# EAGLE design motadora (EAGLE 8.2.0)
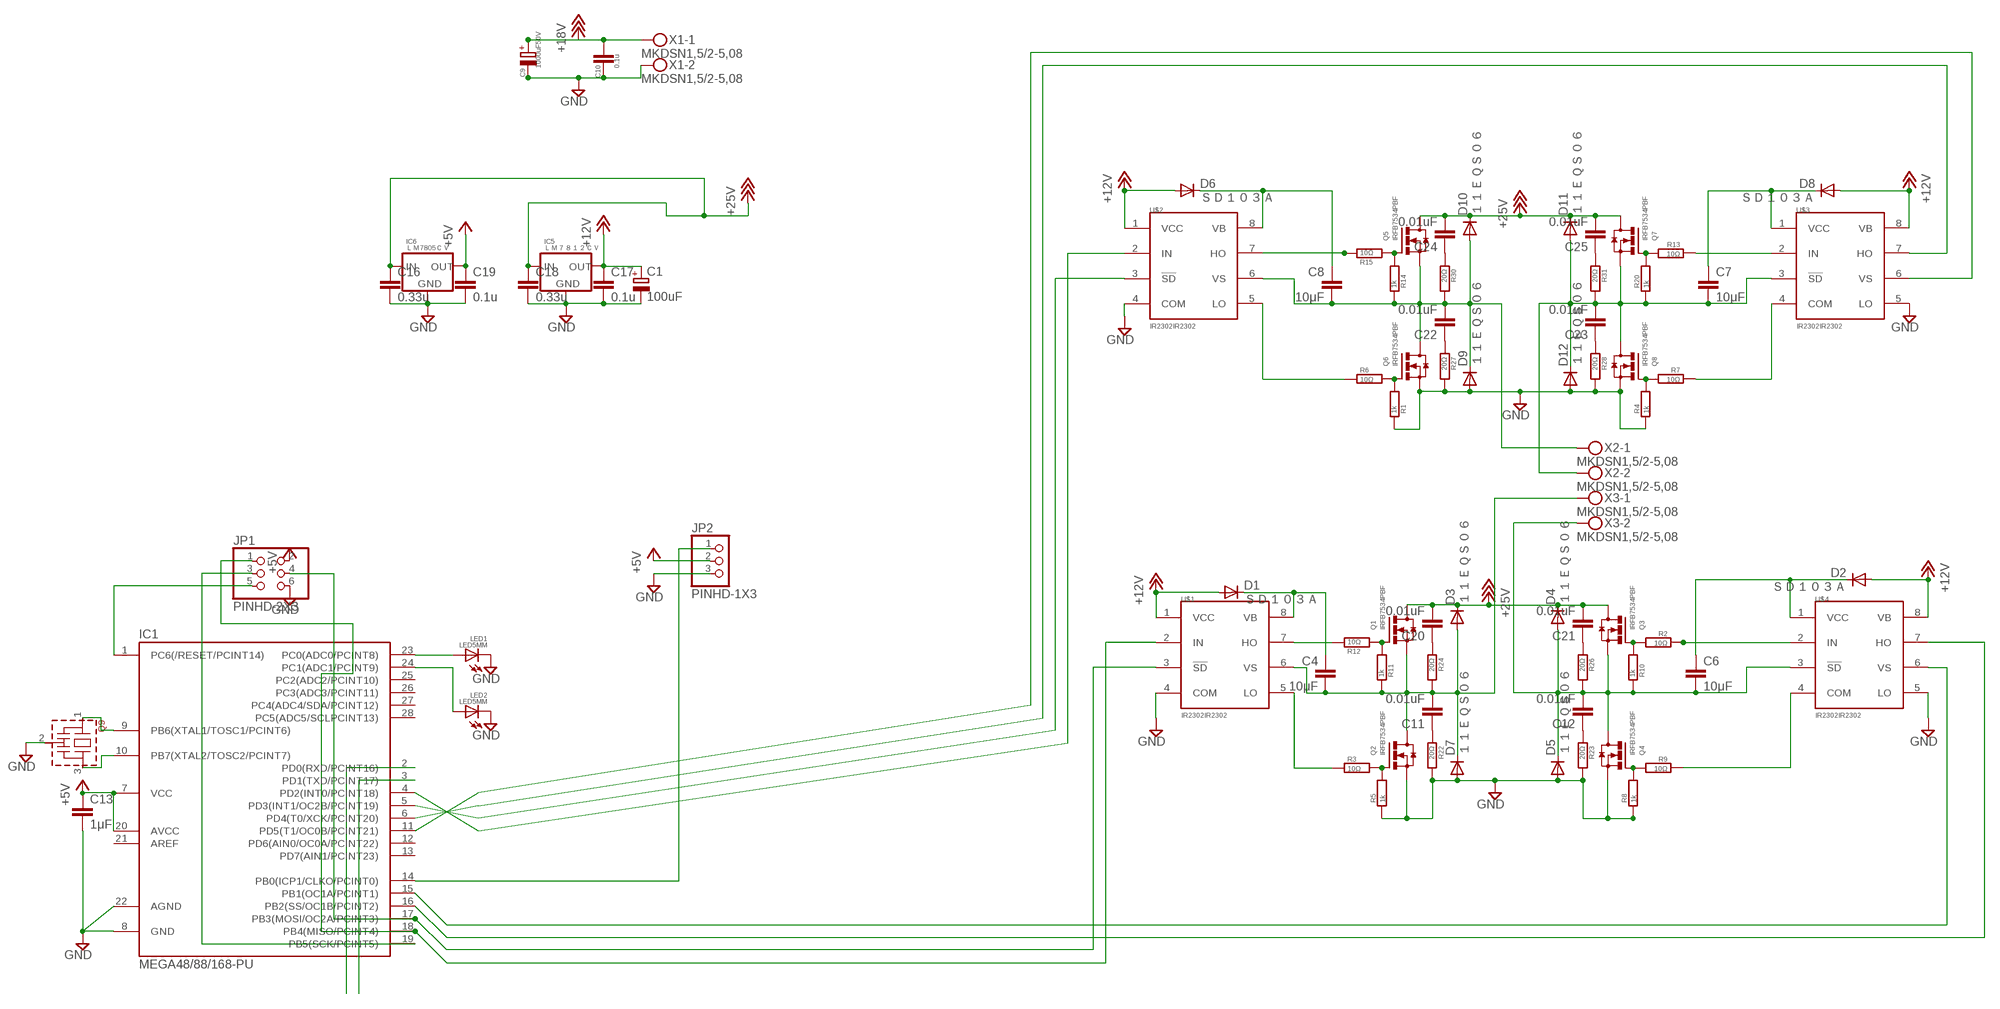
[diagram p0: schematic, sheet 1]

## Parts
C1  100uF  CPOL-EUTT2D6  [TT2D6]
C4  10μF  C-EU025-025X050  [C025-025X050]
C6  10μF  C-EU025-025X050  [C025-025X050]
C7  10μF  C-EU025-025X050  [C025-025X050]
C8  10μF  C-EU025-025X050  [C025-025X050]
C9  1000uF50V  CPOL-E2.5-7  [E2,5-7]
C10  0.1u  C-025-025X050  [C025-025X050]
C11  0.01uF  C-EU025-024X044  [C025-024X044]
C12  0.01uF  C-EU025-024X044  [C025-024X044]
C13  1μF  C-EU050-025X075  [C050-025X075]
C16  0.33u  C-EU025-025X050  [C025-025X050]
C17  0.1u  C-EU025-025X050  [C025-025X050]
C18  0.33u  C-EU025-025X050  [C025-025X050]
C19  0.1u  C-EU025-025X050  [C025-025X050]
C20  0.01uF  C-EU025-024X044  [C025-024X044]
C21  0.01uF  C-EU025-024X044  [C025-024X044]
C22  0.01uF  C-EU025-024X044  [C025-024X044]
C23  0.01uF  C-EU025-024X044  [C025-024X044]
C24  0.01uF  C-EU025-024X044  [C025-024X044]
C25  0.01uF  C-EU025-024X044  [C025-024X044]
D1  ＳＤ１０３Ａ  DIODE-D-5  [D-5]
D2  ＳＤ１０３Ａ  DIODE-D-5  [D-5]
D3  １１ＥＱＳ０６  DIODE-D-5  [D-5]
D4  １１ＥＱＳ０６  DIODE-D-5  [D-5]
D5  １１ＥＱＳ０６  DIODE-D-5  [D-5]
D6  ＳＤ１０３Ａ  DIODE-D-5  [D-5]
D7  １１ＥＱＳ０６  DIODE-D-5  [D-5]
D8  ＳＤ１０３Ａ  DIODE-D-5  [D-5]
D9  １１ＥＱＳ０６  DIODE-D-5  [D-5]
D10  １１ＥＱＳ０６  DIODE-D-5  [D-5]
D11  １１ＥＱＳ０６  DIODE-D-5  [D-5]
D12  １１ＥＱＳ０６  DIODE-D-5  [D-5]
IC1  MEGA48/88/168-PU  [DIL28-3]
IC5  ＬＭ７８１２ＣＶ  V-REGTO-92  [TO-92]
IC6  ＬＭ7805ＣＶ  V-REGTO-92  [TO-92]
JP1  PINHD-2X3  [2X03]
JP2  PINHD-1X3  [1X03]
LED1  LED5MM  [LED5MM]
LED2  LED5MM  [LED5MM]
Q1  IRFB7534PBF  MOS-FET_NTO-220_2  [TO220_2]
Q2  IRFB7534PBF  MOS-FET_NTO-220_2  [TO220_2]
Q3  IRFB7534PBF  MOS-FET_NTO-220_2  [TO220_2]
Q4  IRFB7534PBF  MOS-FET_NTO-220_2  [TO220_2]
Q5  IRFB7534PBF  MOS-FET_NTO-220_2  [TO220_2]
Q6  IRFB7534PBF  MOS-FET_NTO-220_2  [TO220_2]
Q7  IRFB7534PBF  MOS-FET_NTO-220_2  [TO220_2]
Q8  IRFB7534PBF  MOS-FET_NTO-220_2  [TO220_2]
Q9  CSTLS_X  [CSTLS_X]
R1  1k  R-EU_1/4W(8MM)  [1/4W(8MM)]
R2  10Ω  R-EU_1/4W(2.5MM)_  [1/4W(2.5MM)_]
R3  10Ω  R-EU_1/4W(2.5MM)_  [1/4W(2.5MM)_]
R4  1k  R-EU_1/4W(8MM)  [1/4W(8MM)]
R5  1k  R-EU_1/4W(8MM)  [1/4W(8MM)]
R6  10Ω  R-EU_1/4W(2.5MM)_  [1/4W(2.5MM)_]
R7  10Ω  R-EU_1/4W(2.5MM)_  [1/4W(2.5MM)_]
R8  1k  R-EU_1/4W(8MM)  [1/4W(8MM)]
R9  10Ω  R-EU_1/4W(2.5MM)_  [1/4W(2.5MM)_]
R10  1k  R-EU_1/4W(8MM)  [1/4W(8MM)]
R11  1k  R-EU_1/4W(8MM)  [1/4W(8MM)]
R12  10Ω  R-EU_1/4W(2.5MM)_  [1/4W(2.5MM)_]
R13  10Ω  R-EU_1/4W(2.5MM)_  [1/4W(2.5MM)_]
R14  1k  R-EU_1/4W(8MM)  [1/4W(8MM)]
R15  10Ω  R-EU_1/4W(2.5MM)_  [1/4W(2.5MM)_]
R20  1k  R-EU_1/4W(8MM)  [1/4W(8MM)]
R22  20Ω  R-EU_1/4W(2.5MM)_  [1/4W(2.5MM)_]
R23  20Ω  R-EU_1/4W(2.5MM)_  [1/4W(2.5MM)_]
R24  20Ω  R-EU_1/4W(2.5MM)_  [1/4W(2.5MM)_]
R26  20Ω  R-EU_1/4W(2.5MM)_  [1/4W(2.5MM)_]
R27  20Ω  R-EU_1/4W(2.5MM)_  [1/4W(2.5MM)_]
R28  20Ω  R-EU_1/4W(2.5MM)_  [1/4W(2.5MM)_]
R30  20Ω  R-EU_1/4W(2.5MM)_  [1/4W(2.5MM)_]
R31  20Ω  R-EU_1/4W(2.5MM)_  [1/4W(2.5MM)_]
U$1  IR2302IR2302  [DIL08]
U$2  IR2302IR2302  [DIL08]
U$3  IR2302IR2302  [DIL08]
U$4  IR2302IR2302  [DIL08]
X1  MKDSN1,5/2-5,08  [MKDSN1,5/2-5,08]
X2  MKDSN1,5/2-5,08  [MKDSN1,5/2-5,08]
X3  MKDSN1,5/2-5,08  [MKDSN1,5/2-5,08]

## Nets
+5V: C13.1 C19.1 IC1.7(VCC) IC1.20(AVCC) IC6.3(OUT) JP1.2 JP2.2
+12V: C1.+ C17.1 D1.A D2.A D6.A D8.A IC5.3(OUT) U$1.1(VCC) U$2.1(VCC) U$3.8(VB) U$4.8(VB)
+18V: C9.+ C10.1 C16.1 C18.1 C20.2 C21.2 C24.2 C25.2 D3.C D4.C D10.C D11.C IC5.1(IN) IC6.1(IN) Q1.2(D) Q3.2(D) Q5.2(D) Q7.2(D) X1.1 ; supply symbol labelled +25V
GND: C1.- C9.- C10.2 C13.2 C16.2 C17.2 C18.2 C19.2 D5.A D7.A D9.A D12.A IC1.8(GND) IC5.2(GND) IC6.2(GND) JP1.6 JP2.3 LED1.K(C) LED2.K(C) Q2.3(S) Q4.3(S) Q6.3(S) Q8.3(S) Q9.2(VSS) R1.1 R4.1 R5.1 R8.1 R22.4 R23.4 R27.4 R28.4 U$1.4(COM) U$2.4(COM) U$3.5(LO) U$4.5(LO) X1.2
N$1: R15.3 U$2.7(HO)
N$2: R13.3 U$3.2(IN)
N$3: R12.3 U$1.7(HO)
N$4: Q2.1(G) R3.4 R5.2
N$5: IC1.10(PB7(XTAL2/TOSC2/PCINT7)) Q9.3
N$6: R6.3 U$2.5(LO)
N$7: Q1.1(G) R11.2 R12.4
N$8: C4.2 C11.2 D3.A D7.C Q1.3(S) Q2.2(D) R11.1 R24.4 U$1.6(VS) X3.1
N$9: C4.1 D1.C U$1.8(VB)
N$10: C6.1 D2.C U$4.1(VCC)
N$11: R3.3 U$1.5(LO)
N$12: C7.1 D8.C U$3.1(VCC)
N$13: Q5.1(G) R14.2 R15.4
N$15: C6.2 C12.2 D4.A D5.C Q3.3(S) Q4.2(D) R10.1 R26.4 U$4.3(!SD) X3.2
N$16: C8.1 D6.C U$2.8(VB)
N$17: Q4.1(G) R8.2 R9.4
N$18: IC1.14(PB0(ICP1/CLKO/PCINT0)) JP2.1
N$19: C7.2 C23.2 D11.A D12.C Q7.3(S) Q8.2(D) R20.1 R31.4 U$3.3(!SD) X2.2
N$20: IC1.17(PB3(MOSI/OC2A/PCINT3)) JP1.4 U$1.3(!SD)
N$21: Q6.1(G) R1.2 R6.4
N$22: IC1.9(PB6(XTAL1/TOSC1/PCINT6)) Q9.1
N$23: IC1.15(PB1(OC1A/PCINT1)) U$4.6(VS)
N$24: IC1.5(PD3(INT1/OC2B/PCINT19)) U$2.3(!SD)
N$25: IC1.2(PD0(RXD/PCINT16))
N$26: Q8.1(G) R4.2 R7.4
N$27: C8.2 C22.2 D9.C D10.A Q5.3(S) Q6.2(D) R14.1 R30.4 U$2.6(VS) X2.1
N$32: IC1.16(PB2(SS/OC1B/PCINT2)) U$4.7(HO)
N$33: IC1.23(PC0(ADC0/PCINT8)) LED1.A
N$34: IC1.24(PC1(ADC1/PCINT9)) LED2.A
N$36: C12.1 R23.3
N$38: C11.1 R22.3
N$39: Q3.1(G) R2.4 R10.2
N$40: R7.3 U$3.4(COM)
N$41: IC1.6(PD4(T0/XCK/PCINT20)) U$3.7(HO)
N$42: C20.1 R24.3
N$43: C21.1 R26.3
N$44: C22.1 R27.3
N$45: C23.1 R28.3
N$46: C24.1 R30.3
N$47: C25.1 R31.3
N$48: R2.3 U$4.2(IN)
N$49: IC1.11(PD5(T1/OC0B/PCINT21)) U$3.6(VS)
N$50: IC1.18(PB4(MISO/PCINT4)) JP1.1 U$1.2(IN)
N$51: Q7.1(G) R13.4 R20.2
N$52: IC1.4(PD2(INT0/PCINT18)) U$2.2(IN)
N$54: R9.3 U$4.4(COM)
N$55: IC1.3(PD1(TXD/PCINT17))
N$56: IC1.19(PB5(SCK/PCINT5)) JP1.3
N$57: IC1.1(PC6(/RESET/PCINT14)) JP1.5
Unconnected: IC1.12(PD6(AIN0/OC0A/PCINT22)) IC1.13(PD7(AIN1/PCINT23)) IC1.21(AREF) IC1.25(PC2(ADC2/PCINT10)) IC1.26(PC3(ADC3/PCINT11)) IC1.27(PC4(ADC4/SDA/PCINT12)) IC1.28(PC5(ADC5/SCLPCINT13))

## Power pins joined to a net without a drawn wire
AGND: IC1.22(AGND)

## Library data of the parts
C1 = _rcl:CPOL-EU: POLARIZED CAPACITOR, European symbol
C4 C6-C8 = _rcl:C-EU: CAPACITOR, European symbol
C9 = !capasiter:CPOL-: POLARIZED CAPACITOR, European symbol
C10 = !capasiter:C-: CAPACITOR, European symbol
C11-C13 C16-C25 = _resistor(抵抗):C-EU: CAPACITOR, European symbol
D1-D12 = _diode(ﾀﾞｲｵｰﾄﾞ):DIODE-: DIODE
IC1 = !avr:MEGA48/88/168-PU
IC5 IC6 = !FET_transister_v-reg2:V-REG
JP1 = !pinhead(ﾋﾟﾝﾍｯﾀﾞ):PINHD-2X3: PIN HEADER
JP2 = !pinhead(ﾋﾟﾝﾍｯﾀﾞ):PINHD-1X3: PIN HEADER
LED1 LED2 = _led:LED
Q1-Q8 = !FET_transister_v-reg2:MOS-FET_N
Q9 = !murata-resonators(ｾﾗﾛｯｸ):CSTLS_X: Ceramic resonator 16.00 to 70.00 MHz
R1-R15 R20 R22-R24 R26-R28 R30 R31 = !resistor(抵抗):R-EU_: RESISTOR, European symbol
U$1-U$4 = !irs(ｹﾞｰﾄﾄﾞﾗｲﾊﾞIC):IR2302
X1-X3 = !con-phoenix-508(ﾀｰﾐﾅﾙ):MKDSN1,5/2-5,08: MKDSN 1,5/ 2-5,08 Printklemme Nennstrom: 13,5 A Nennspannung: 250 V Rastermaß: 5,08 mm Polzahl: 2 Anschlussart: Schraubanschluss Montage: Löten Anschlussrichtung Leiter/Platine: 0 ° Artikelnummer: 1729128 Source: http://eshop.phoenixcontact.com .. 1729128.pdf; MPN: MKDSN 1,5/2-5.08; OC_FARNELL: 1792903; OC_NEWARK: 30M2397

## Board
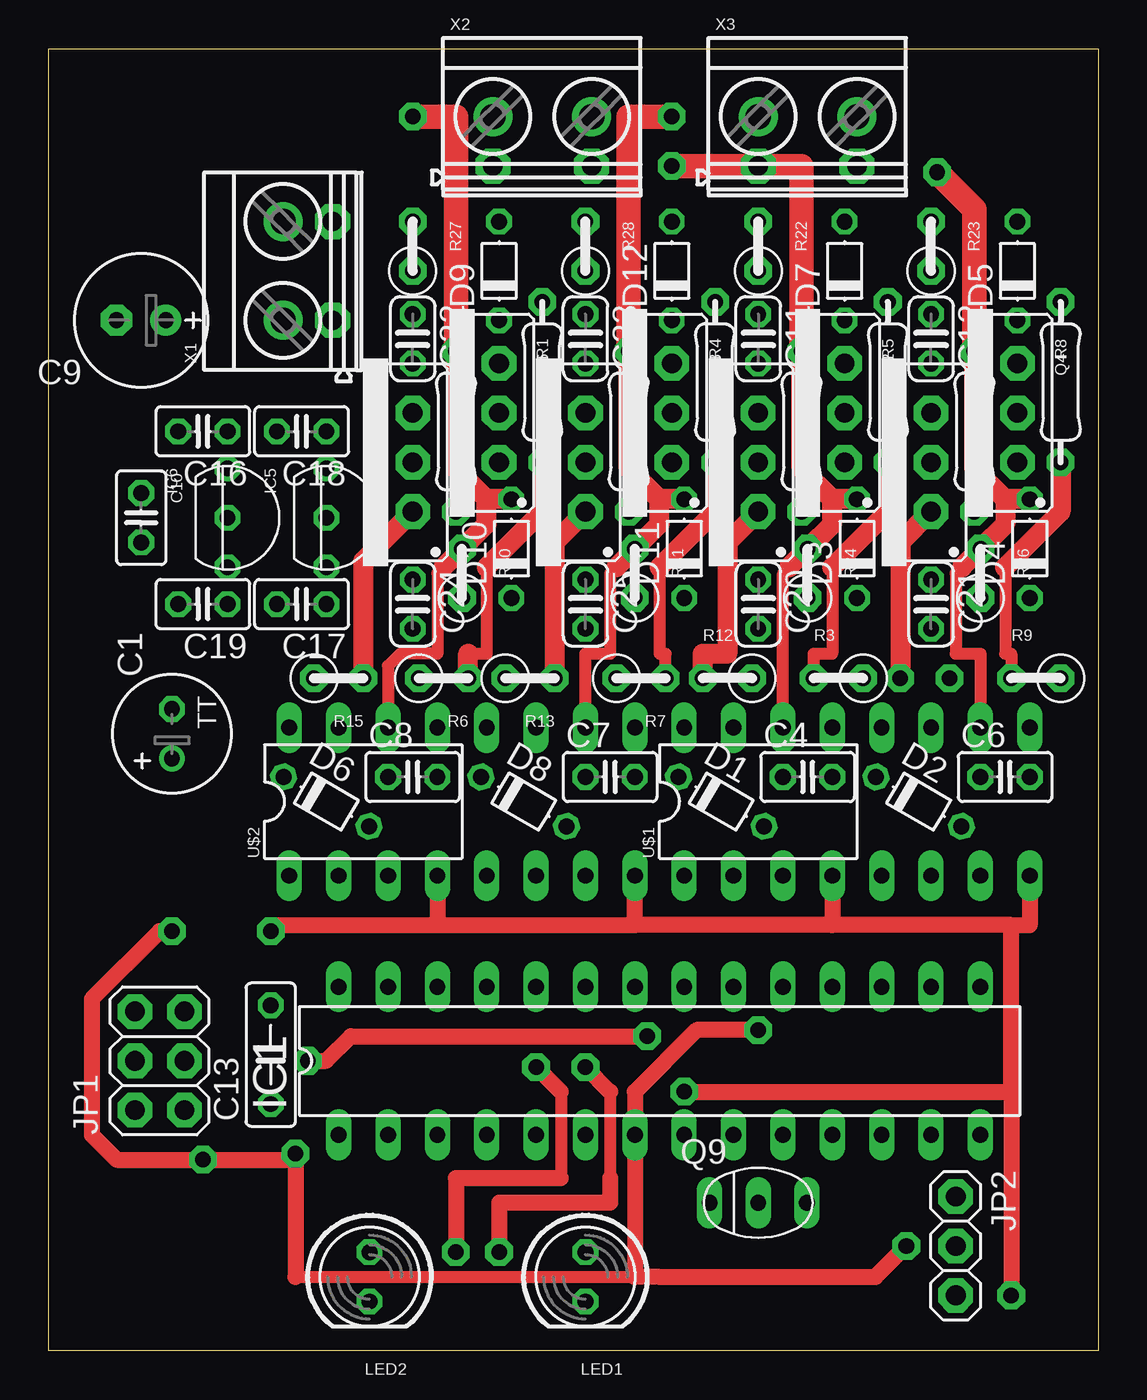
[diagram p1: board, top side]
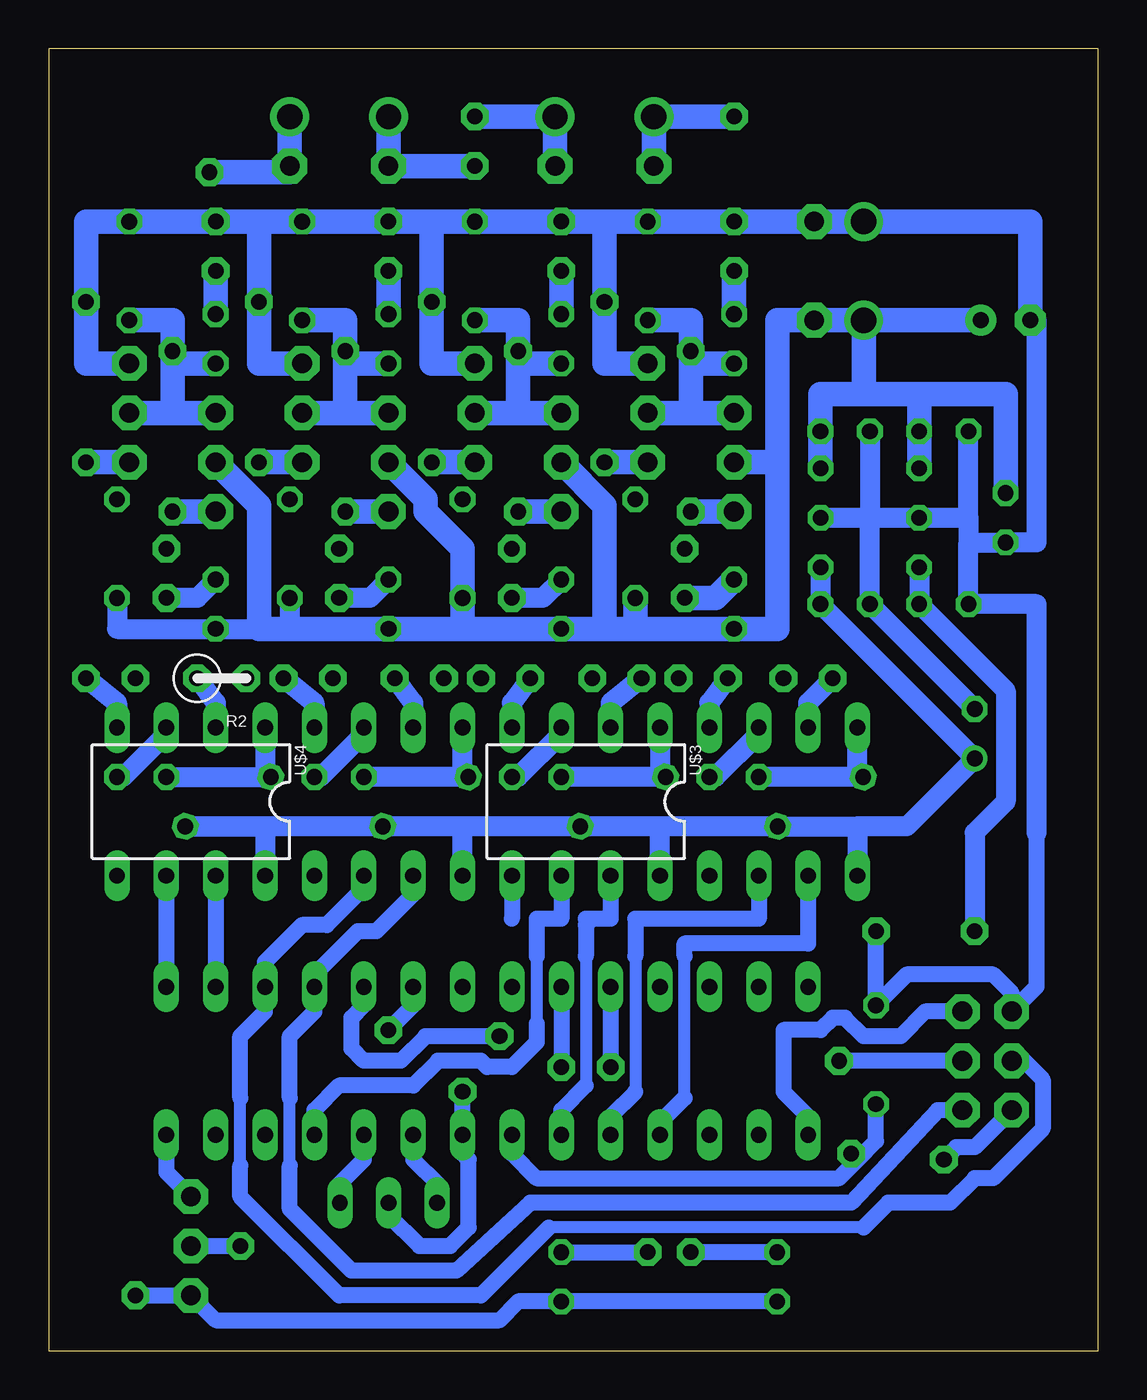
[diagram p2: board, bottom side, seen from below]

Size 54 x 67 mm. Coordinates in mm from the lower left corner, seen from the top.
Outline: 0,0 0,67 54,67 54,0 0,0
Copper layers (1*16): Top 0.035mm / dielectric 1.5mm / Bottom 0.035mm
Design rules "default *": minimum track width 10mil, minimum drill 24mil, track to track 8mil, track to pad 8mil, pad to pad 8mil, via to via 8mil, smd to smd 8mil, copper to edge 0.7mm, drill to drill 8mil, minimum pad ring 10mil, minimum via ring 8mil, stop-mask expansion 4mil, vias tented up to drill 0mil, thermal gap 10mil

### Footprints (pad centres in the part's own frame; a part is rotated, then mirrored left to right if it is on the bottom)
TT2D6 = drill 0.813: + -1.27,0 | drill 0.813 octagon: - 1.27,0
C025-025X050 = drill 0.813 octagon: 1 -1.27,0; 2 1.27,0
E2,5-7 = drill 0.813 pad 1.6: + -1.27,0 | drill 0.813 pad 1.6 octagon: - 1.27,0
C025-024X044 = drill 0.813 octagon: 1 -1.27,0; 2 1.27,0
C050-025X075 = drill 0.813 octagon: 1 -2.54,0; 2 2.54,0
D-5 = drill 0.813 octagon: A 2.54,0; C -2.54,0
DIL28-3 = drill 0.813 long: 1 -16.51,-3.81; 2 -13.97,-3.81; 3 -11.43,-3.81; 4 -8.89,-3.81; 5 -6.35,-3.81; 6 -3.81,-3.81; 7 -1.27,-3.81; 8 1.27,-3.81; 9 3.81,-3.81; 10 6.35,-3.81; 11 8.89,-3.81; 12 11.43,-3.81; 13 13.97,-3.81; 14 16.51,-3.81; 15 16.51,3.81; 16 13.97,3.81; 17 11.43,3.81; 18 8.89,3.81; 19 6.35,3.81; 20 3.81,3.81; 21 1.27,3.81; 22 -1.27,3.81; 23 -3.81,3.81; 24 -6.35,3.81; 25 -8.89,3.81; 26 -11.43,3.81; 27 -13.97,3.81; 28 -16.51,3.81
TO-92 = drill 0.8 octagon: 1 -2.54,0; 2 0,0; 3 2.54,0
2X03 = drill 1.016 pad 1.778 octagon: 1 -2.54,-1.27; 2 -2.54,1.27; 3 0,-1.27; 4 0,1.27; 5 2.54,-1.27; 6 2.54,1.27
1X03 = drill 1.016 pad 1.778 octagon: 1 -2.54,0; 2 0,0; 3 2.54,0
LED5MM = drill 0.813 octagon: A -1.27,0; K 1.27,0
TO220_2 = drill 1.016 pad 1.778 octagon: 1 -2.54,0; 2 0,0; 3 2.54,0
CSTLS_X = drill 0.813 long: 1 -2.5,0; 2 0,0; 3 2.5,0
1/4W(8MM) = drill 0.8 pad 1.422 octagon: 1 -4.128,0; 2 4.128,0
1/4W(2.5MM)_ = drill 0.8 pad 1.422 octagon: 3 1.27,0; 4 -1.27,0
DIL08 = drill 0.813 long: 1 -3.81,-3.81; 2 -1.27,-3.81; 3 1.27,-3.81; 4 3.81,-3.81; 5 3.81,3.81; 6 1.27,3.81; 7 -1.27,3.81; 8 -3.81,3.81
MKDSN1,5/2-5,08 = drill 1.3 pad 2: 1 -2.54,0; 2 2.54,0

### Placement (x,y rotation side)
C1  6.35,31.75 90 top
C4  39.05,29.53 0 top
C6  49.21,29.53 0 top
C7  28.89,29.53 0 top
C8  18.73,29.53 0 top
C9  4.76,53.02 180 top
C10  4.76,42.86 270 top
C11  36.51,52.07 270 top
C12  45.4,52.07 270 top
C13  11.43,15.24 90 top
C16  7.94,47.31 180 top
C17  13.02,38.42 180 top
C18  13.02,47.31 180 top
C19  7.94,38.42 180 top
C20  36.51,38.42 270 top
C21  45.4,38.42 270 top
C22  18.73,52.07 270 top
C23  27.62,52.07 270 top
C24  18.73,38.42 270 top
C25  27.62,38.42 270 top
D1  34.61,28.26 330 top
D2  44.77,28.26 330 top
D3  41.59,41.27 90 top
D4  50.48,41.27 90 top
D5  49.85,55.56 90 top
D6  14.29,28.26 330 top
D7  40.96,55.56 90 top
D8  24.45,28.26 330 top
D9  23.18,55.56 90 top
D10  23.81,41.27 90 top
D11  32.7,41.27 90 top
D12  32.07,55.56 90 top
IC1  31.43,14.92 0 top
IC5  14.29,42.86 270 top
IC6  9.21,42.86 270 top
JP1  5.71,14.92 90 top
JP2  46.67,5.4 270 top
LED1  27.62,3.81 270 top
LED2  16.51,3.81 270 top
Q1  36.51,45.72 90 top
Q2  40.96,48.26 90 top
Q3  45.4,45.72 90 top
Q4  49.85,48.26 90 top
Q5  18.73,45.72 90 top
Q6  23.18,48.26 90 top
Q7  27.62,45.72 90 top
Q8  32.07,48.26 90 top
Q9  36.51,7.62 0 top
R1  25.4,49.85 270 top
R2  45.09,34.61 180 bottom
R3  40.64,34.61 0 top
R4  34.29,49.85 270 top
R5  43.18,49.85 270 top
R6  20.32,34.61 180 top
R7  30.48,34.61 180 top
R8  52.07,49.85 270 top
R9  50.8,34.61 0 top
R10  47.62,47.31 270 top
R11  38.73,47.31 270 top
R12  34.92,34.61 0 top
R13  24.77,34.61 180 top
R14  20.95,47.31 270 top
R15  14.92,34.61 180 top
R20  29.84,47.31 270 top
R22  36.51,56.83 270 top
R23  45.4,56.83 270 top
R24  39.05,40.01 270 top
R26  47.94,40.01 270 top
R27  18.73,56.83 270 top
R28  27.62,56.83 270 top
R30  21.27,40.01 270 top
R31  30.16,40.01 270 top
U$1  36.51,28.26 0 top
U$2  16.19,28.26 0 top
U$3  26.35,28.26 180 bottom
U$4  46.67,28.26 180 bottom
X1  12.06,55.56 90 top
X2  25.4,63.5 0 top
X3  39.05,63.5 0 top

### Tracks (layer width: path | path; a pad name or v marks a point on that pad's centre or on a via)
+5V  (via drill 0.8 pad 1.42)
  Top 0.61: 12.7,3.81 31.43,3.81
  Top 0.813: v6.35,21.59 5.71,21.59 2.22,18.1 2.22,11.11 3.49,9.84 v7.94,9.84 12.38,9.84 v12.7,10.16 12.7,3.81 | v44.13,5.4 42.55,3.81 31.43,3.81 30.16,3.81 IC1.7 30.16,13.34 33.34,16.51 v36.51,16.51
  Bottom 0.813: IC1.7 30.16,10.16 28.89,8.89 13.34,8.89 12.38,9.84 | 12.38,9.84 11.43,10.79 C13.1 | JP1.2 6.35,10.48 7.3,10.48 v7.94,9.84 | v12.7,10.16 12.38,9.84 | JP2.2 v44.13,5.4 | IC1.20 35.24,17.78 v36.51,16.51
  Bottom 1.016: IC6.3 C19.1 4.76,33.97 4.76,28.26 6.35,26.67 v6.35,21.59 6.46,21.7
+12V
  Bottom 1.016: IC5.3 C17.1 | C17.1 14.29,38.73 | U$4.8 42.86,26.99 D2.A D1.A 32.7,26.99 | 32.7,26.99 D8.A 22.54,26.99 | U$1.1 32.7,26.99 | U$3.8 22.54,26.99 | 22.54,26.99 D6.A 12.38,26.99 | 12.38,26.99 U$2.1 | 12.38,26.99 12.06,26.99 9.84,26.99 C1.+ C17.1
+18V  (via drill 1 pad 1.8)
  Bottom 1.016: D3.C 41.59,37.15 | D4.C 50.48,37.15 C21.2 43.18,37.15
  Bottom 1.27: Q7.2 25.4,43.5 25.4,37.15 | Q5.2 16.51,45.72 | 25.4,37.15 23.81,37.15 | 23.81,37.15 C24.2 16.51,37.15 16.51,45.72 | 32.7,37.15 C25.2 25.4,37.15 | Q3.2 43.18,43.5 43.18,37.15 41.59,37.15 C20.2 32.7,37.15 | IC6.1 C16.1 9.21,49.21 | IC5.1 C18.1 14.29,49.21 12.06,49.21 | 16.51,45.72 16.51,53.02 v14.61,53.02 X1.1 | 32.7,37.15 D11.C 32.7,41.27 34.61,43.18 34.61,43.81 Q1.2 | D10.C 23.81,37.15 | C10.1 4.76,49.21 9.21,49.21 | 9.21,49.21 12.06,49.21 | 12.06,49.21 X1.1 | C9.+ X1.1
GND  (via drill 0.8 pad 1.42, 1 pad 1.8)
  Top 0.813: 20,21.91 30.16,21.91 | 30.16,21.91 U$3.5 | U$4.5 50.48,21.91 49.53,21.91 | 49.53,21.91 40.32,21.91 | 40.32,21.91 30.16,21.91 | U$1.4 40.32,21.91 | U$2.4 20,21.91 | v11.43,21.59 11.43,21.91 20,21.91 | 49.53,13.34 v49.53,2.86 | 49.53,13.34 49.53,21.91 | v32.7,13.34 49.53,13.34
  Bottom 0.813: U$3.5 30.16,22.23 | Q9.2 36.51,6.99 34.92,5.4 33.34,5.4 32.38,6.35 32.38,9.84 32.7,10.16 IC1.8 v32.7,13.34 | 3.17,26.67 3.17,18.73 JP1.6 4.45,18.41 5.4,19.37 9.84,19.37 C13.2 v11.43,21.59 | v49.53,2.86 JP2.3 45.4,1.59 30.8,1.59 29.84,2.54 LED1.K LED2.K
  Bottom 1.016: 6.67,42.86 IC6.2 11.75,42.86 | 6.67,41.59 C19.2 3.17,38.42 3.17,26.67 | IC5.2 11.75,42.86 | 6.67,42.86 C16.2 | C18.2 11.75,42.86 | 11.75,42.86 C17.2 C1.- | 6.67,42.86 6.67,41.59 | 6.67,41.59 C10.2 3.17,41.59 3.17,53.02 C9.-
  Bottom 1.27: 34.29,58.1 D12.A R28.4 25.4,58.1 | Q8.3 34.29,50.8 R4.1 34.29,58.1 | Q6.3 25.4,50.8 R1.1 | 25.4,51.75 R1.1 | 25.4,58.1 D9.A R27.4 v14.61,58.1 X1.2 3.49,58.1 C9.- | R1.1 25.4,58.1 | 34.29,58.1 R22.4 D7.A 43.18,58.1 | Q4.3 52.07,50.8 R8.1 52.07,58.1 D5.A R23.4 43.18,58.1 | Q2.3 43.18,50.8 R5.1 43.18,58.1
N$1
  Bottom 1.016: R15.3 14.92,33.34 U$2.7
N$2
  Bottom 1.016: R13.3 25.08,33.34 U$3.2
N$3
  Bottom 1.016: R12.3 35.24,33.34 U$1.7
N$4
  Top 0.61: 40.32,40.32 40.32,35.88 39.37,35.88 R3.4
  Top 1.016: R5.2 43.18,43.18 40.32,40.32
  Bottom 1.27: Q2.1 R5.2
N$5
  Bottom 0.813: IC1.10 37.78,9.84 39.05,8.57 39.05,7.66 Q9.3
N$6
  Bottom 1.016: R6.3 20,33.34 U$2.5
N$7
  Top 1.016: Q1.1 34.92,41.59 34.92,35.88 33.66,35.88 R12.4
  Bottom 1.27: Q1.1 R11.2
N$8  (via drill 0.8 pad 1.42, 1 pad 1.8)
  Top 0.61: U$1.6 37.78,40.01 38.1,40.32
  Top 1.016: D3.A 40.32,43.81 | 40.32,43.81 38.73,45.4 R11.1 | 40.32,43.81 40.32,42.55 R24.4 38.1,40.32
  Top 1.27: R11.1 38.73,60.96 v36.51,60.96 v32.07,60.96
  Bottom 1.016: C4.2 40.01,29.53 37.78,31.75 U$1.6
  Bottom 1.27: Q1.3 38.73,48.26 | 38.73,48.26 R11.1 | R11.1 38.73,48.58 | 38.73,48.26 Q2.2 | R11.1 38.73,53.02 D7.C | R11.1 38.73,50.8 C11.2 | v32.07,60.96 v36.51,60.96 X3.1
N$9
  Bottom 1.016: 32.73,32.05 U$1.8 32.7,29.82 D1.C C4.1
N$10
  Bottom 1.016: C6.1 D2.C 42.86,29.55 U$4.1
N$11
  Bottom 1.016: R3.3 40.32,33.34 U$1.5
N$12
  Bottom 1.016: U$3.1 22.54,29.55 D8.C C7.1
N$13
  Top 1.016: R15.4 16.19,40.64 Q5.1
  Bottom 1.27: R14.2 Q5.1
N$15  (via drill 0.8 pad 1.42, 1 pad 1.8)
  Top 0.61: U$4.3 47.94,35.88 46.67,35.88 46.67,40.01 46.99,40.32
  Top 1.016: D4.A 49.21,43.81 | 49.21,43.81 47.62,45.4 R10.1 | 49.21,43.81 49.21,42.55 R26.4 46.99,40.32
  Top 1.27: R10.1 47.62,58.74 v45.72,60.64
  Bottom 1.016: C6.2 50.16,29.53 47.94,31.75 U$4.3
  Bottom 1.27: Q3.3 47.62,48.26 | R10.1 47.62,48.26 | 47.62,48.26 Q4.2 | D5.C 47.62,53.02 R10.1 | R10.1 47.62,50.8 C12.2 | v45.72,60.64 41.59,60.64 v41.59,60.96 X3.2
N$16
  Bottom 1.016: 12.38,29.53 U$2.8 | 12.38,29.53 D6.C | 12.38,29.53 C8.1
N$17
  Top 0.61: 49.21,40.32 49.21,35.88 49.53,35.88 R9.4
  Top 1.016: R8.2 52.07,43.18 49.21,40.32
  Bottom 1.27: Q4.1 R8.2
N$18
  Bottom 0.813: IC1.14 47.94,9.21 JP2.1
N$19  (via drill 0.8 pad 1.42, 1 pad 1.8)
  Top 0.61: U$3.3 27.62,35.88 28.89,35.88 28.89,40.01 29.21,40.32
  Top 1.016: D11.A 31.43,43.81 | 31.43,43.81 29.84,45.4 R20.1 | 31.43,43.81 31.43,42.55 R31.4 29.21,40.32
  Top 1.27: R20.1 29.84,63.5 v32.07,63.5
  Bottom 1.016: C7.2 29.84,29.53 27.62,31.75 U$3.3
  Bottom 1.27: R20.1 29.84,48.26 | 29.84,48.26 Q7.3 | Q8.2 29.84,48.26 | 29.84,48.58 R20.1 | R20.1 29.84,50.8 C23.2 | D12.C 29.84,53.02 R20.1 | v32.07,63.5 X2.2 v27.94,60.96
N$20
  Bottom 0.61: 44.13,9.53 44.13,13.02 | 12.06,6.35 28.26,6.35
  Bottom 0.813: U$1.3 37.78,23.81 39.69,21.91 40.96,21.91 42.86,20 IC1.17 42.86,17.46 44.13,16.19 44.13,13.02 | JP1.4 3.81,14.92 2.86,13.97 2.86,11.43 5.4,8.89 6.35,8.89 7.62,7.62 10.79,7.62 12.06,6.35 | 28.26,6.35 31.75,2.86 39.05,2.86 44.13,7.94 44.13,9.53
N$21
  Top 0.61: 22.54,40.32 22.54,35.88 21.59,35.88
  Top 1.016: R1.2 25.4,43.18 22.54,40.32 | R6.4 21.59,35.88
  Bottom 1.27: Q6.1 R1.2
N$22
  Bottom 0.813: IC1.9 35.24,9.84 33.97,8.57 33.97,7.66 Q9.1
N$23
  Bottom 0.813: U$4.6 IC1.15
N$24
  Bottom 0.61: 23.81,20.32 23.81,13.34
  Bottom 0.813: U$2.3 17.46,22.23 23.81,22.23 23.81,20.32 | 23.81,13.34 25.08,12.06 IC1.5
N$26
  Top 0.61: 31.43,40.32 31.43,35.88 31.75,35.88 R7.4
  Top 1.016: R4.2 34.29,43.18 31.43,40.32
  Bottom 1.27: Q8.1 R4.2
N$27  (via drill 0.8 pad 1.42, 1 pad 1.8)
  Top 0.61: U$2.6 17.46,35.24 18.1,35.88 20,35.88 20,40.01 20.32,40.32
  Top 1.016: D10.A 22.54,43.81 | 22.54,43.81 20.95,45.4 R14.1 | 22.54,43.81 22.54,42.55 R30.4 20.32,40.32
  Top 1.27: R14.1 20.95,63.5 v18.73,63.5
  Bottom 1.016: C8.2 19.68,29.53 17.46,31.75 U$2.6
  Bottom 1.27: R14.1 20.95,48.26 | 20.95,48.26 Q6.2 | Q5.3 20.95,48.26 | 20.95,48.58 R14.1 | R14.1 20.95,50.8 C22.2 | D9.C 20.95,53.02 R14.1 | v18.73,63.5 X2.1 v22.86,60.96
N$32
  Bottom 0.813: U$4.7 IC1.16
N$33  (via drill 0.8 pad 1.42)
  Top 0.61: 28.89,13.34 28.89,8.89
  Top 0.813: v27.62,14.61 28.89,13.34 | 28.89,8.89 28.89,7.62 23.18,7.62 v23.18,5.08
  Bottom 0.813: LED1.A v23.18,5.08 | IC1.23 v27.62,14.61
N$34  (via drill 0.8 pad 1.42)
  Top 0.61: 26.35,13.34 26.35,8.89
  Top 0.813: v25.08,14.61 26.35,13.34 | 26.35,8.89 20.95,8.89 v20.95,5.08
  Bottom 0.813: LED2.A v20.95,5.08 | IC1.24 v25.08,14.61
N$36
  Bottom 1.27: C12.1 R23.3
N$38
  Bottom 1.27: C11.1 R22.3
N$39
  Top 1.016: R2.4 43.81,41.59 Q3.1
  Bottom 1.27: Q3.1 R10.2
N$40
  Bottom 1.016: R7.3 30.16,33.34 U$3.4
N$41
  Bottom 0.61: 26.35,20.32 26.35,13.65
  Bottom 0.813: U$3.7 25.08,22.23 26.04,22.23 | 26.04,22.23 26.35,22.23 | 26.04,22.23 26.35,21.91 26.35,20.32 | 26.35,13.65 27.62,12.38 IC1.6
N$42
  Bottom 1.016: C20.1 37.47,38.73 R24.3
N$43
  Bottom 1.016: C21.1 46.35,38.73 R26.3
N$44
  Bottom 1.27: R27.3 C22.1
N$45
  Bottom 1.27: C23.1 R28.3
N$46
  Bottom 1.27: C24.1 19.68,38.73 R30.3
N$47
  Bottom 1.016: C25.1 28.57,38.73 R31.3
N$48
  Bottom 1.016: R2.3 45.4,33.34 U$4.2
N$49
  Bottom 0.61: 28.89,20.32 28.89,16.83
  Bottom 0.813: U$3.6 27.62,22.23 28.89,22.23 28.89,20.32 | 28.89,16.83 28.89,15.88 30.16,14.61 31.43,14.61 31.75,14.92 33.97,14.92 35.24,13.65 39.05,13.65 40.32,12.38 IC1.11
N$50
  Bottom 0.61: 41.59,9.53 41.59,13.02
  Bottom 0.813: U$1.2 35.24,23.5 37.15,21.59 38.1,21.59 40.32,19.37 IC1.18 40.32,17.46 41.59,16.19 41.59,13.02 | JP1.1 8.26,12.38 12.7,7.62 29.21,7.62 33.02,4.13 38.42,4.13 41.59,7.3 41.59,9.53
N$51
  Top 1.016: Q7.1 26.04,41.59 R13.4
  Bottom 1.27: R20.2 Q7.1
N$52
  Bottom 0.61: 21.27,13.02 21.27,20.32
  Bottom 0.813: U$2.2 14.92,20.95 21.27,20.95 21.27,20.32 | IC1.4 22.54,11.75 21.27,13.02
N$54
  Bottom 1.016: R9.3 50.48,33.34 U$4.4
N$56  (via drill 0.8 pad 1.42)
  Top 0.813: v13.34,14.92 14.29,14.92 15.56,16.19 v30.8,16.19
  Bottom 0.813: v30.8,16.19 34.61,16.19 35.88,14.92 37.78,14.92 38.42,15.56 38.42,17.14 37.78,17.78 IC1.19 | JP1.3 v13.34,14.92
N$57
  Bottom 0.813: JP1.5 8.89,17.46 10.16,16.19 12.06,16.19 13.02,17.14 13.65,17.14 14.29,16.51 16.19,16.51 16.19,13.34 14.92,12.06 IC1.1